# EAGLE design ESP01-1wire (EAGLE 7.5.0)
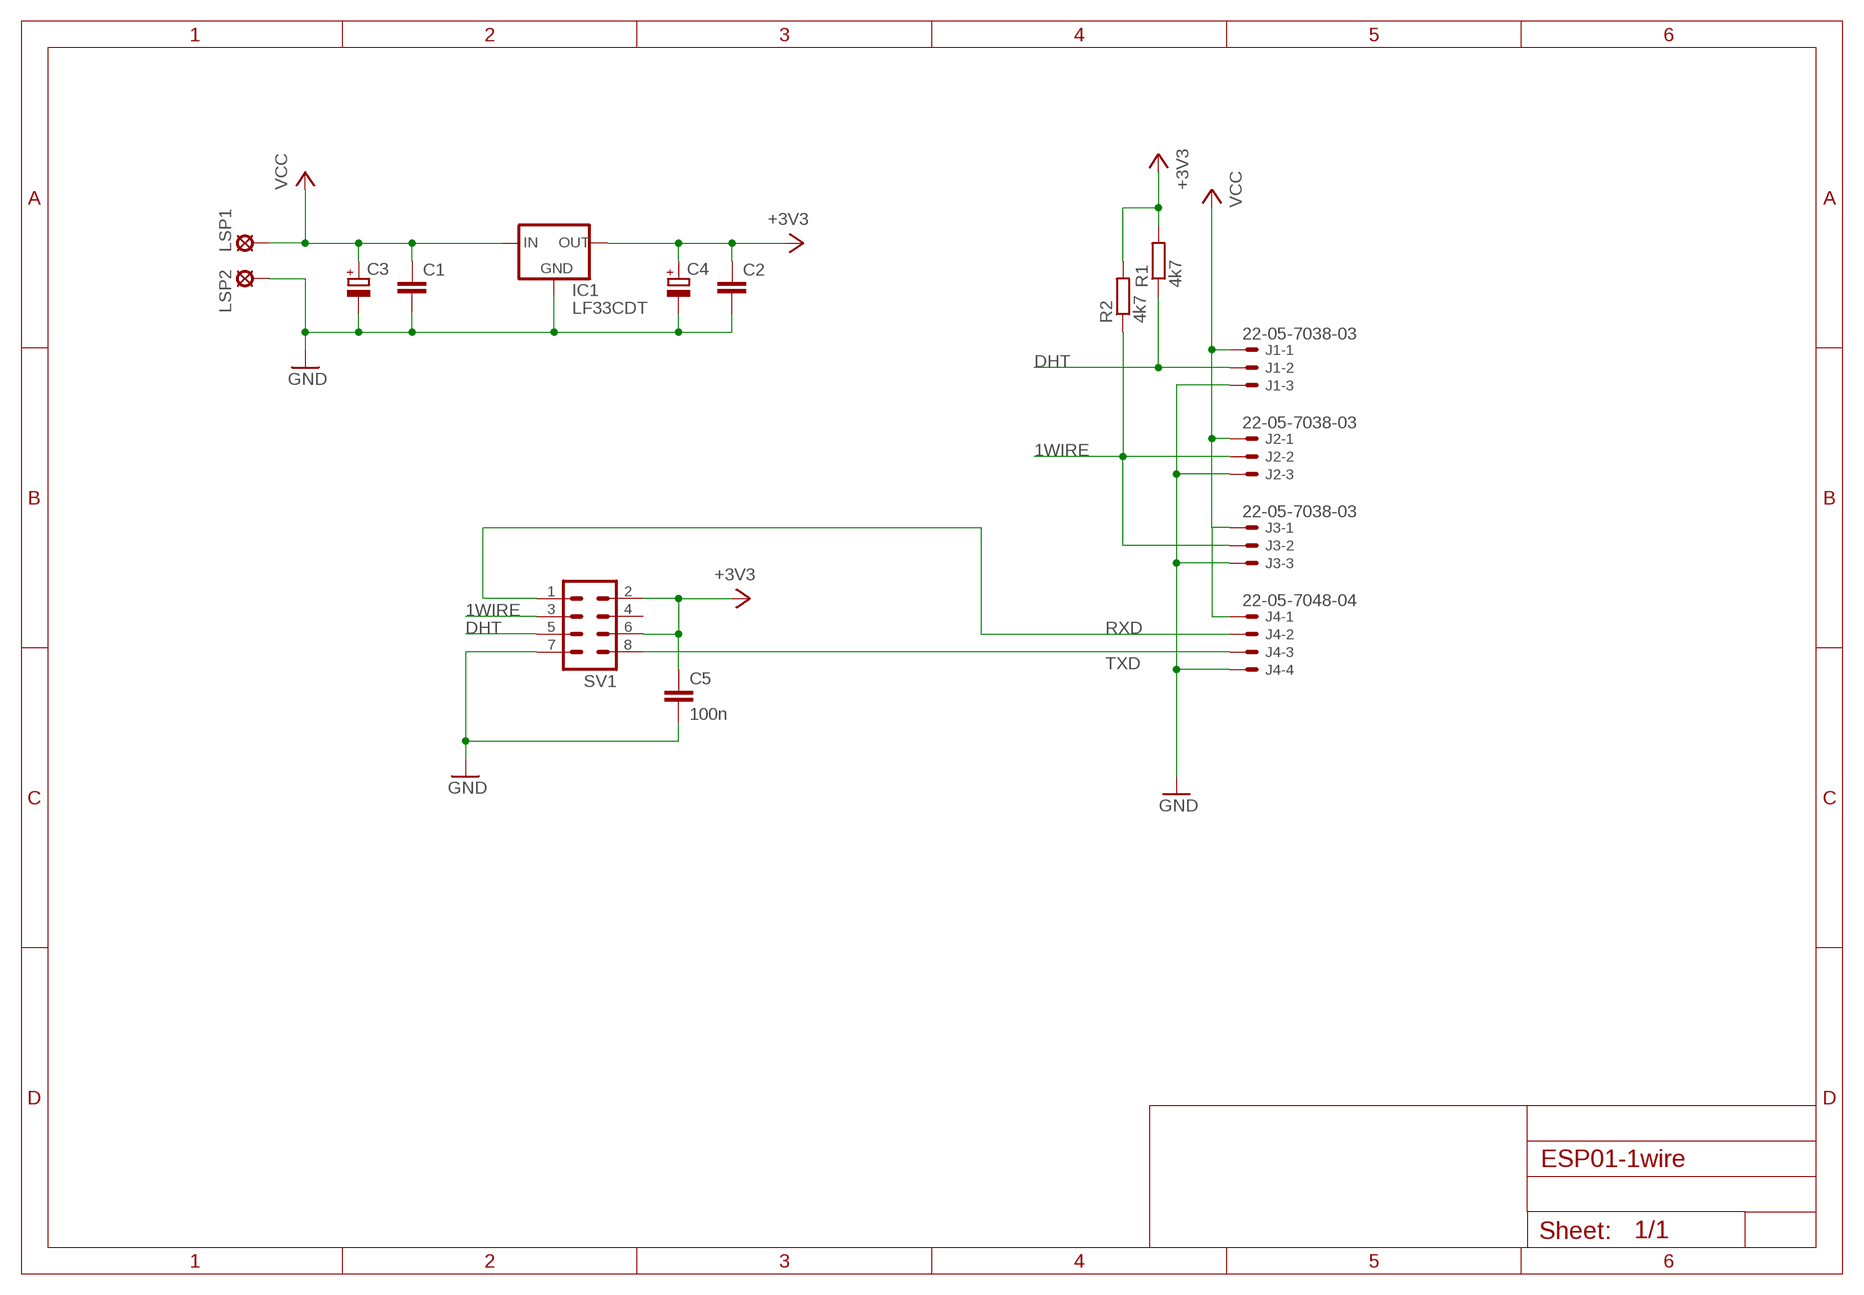
[diagram p0: schematic, sheet 1]

## Parts
C1  C-EUC0805  [C0805]
C2  C-EUC0805  [C0805]
C3  CPOL-EUSMCA  [SMC_A]
C4  CPOL-EUSMCA  [SMC_A]
C5  100n  C-EUC0805  [C0805]
IC1  LF33CDT  LP2950CDT-3.3  [DPACK]
J1  22-05-7038-03  [7395-03]
J2  22-05-7038-03  [7395-03]
J3  22-05-7038-03  [7395-03]
J4  22-05-7048-04  [7395-04]
LSP1  LSP10  [LSP10]
LSP2  LSP10  [LSP10]
R1  4k7  R-EU_R0805  [R0805]
R2  4k7  R-EU_R0805  [R0805]
SV1  MA04-2  [MA04-2]

## Nets
1WIRE: J2.2 J3.2 R2.1 SV1.3
+3V3: C2.1 C4.+ C5.1 IC1.3(OUT) R1.2 R2.2 SV1.2 SV1.6
DHT: J1.2 R1.1 SV1.5
GND: C1.2 C2.2 C3.- C4.- C5.2 IC1.4(GND) J1.3 J2.3 J3.3 J4.4 LSP2.MP SV1.7
RXD: J4.2 SV1.1
TXD: J4.3 SV1.8
VCC: C1.1 C3.+ IC1.1(IN) J1.1 J2.1 J3.1 J4.1 LSP1.MP
Unconnected: SV1.4

## Library data of the parts
C1 C2 C5 = rcl:C-EU: CAPACITOR, European symbol
C3 C4 = rcl:CPOL-EU: POLARIZED CAPACITOR, European symbol
IC1 = v-reg:LP2950?*: Source: http://cache.national.com/ds/LP/LP2950.pdf
J1-J3 = con-molex:22-?-03: CONNECTOR wire to board 2.54 mm (.1 inch) pitch header; OC_FARNELL: unknown; OC_NEWARK: unknown
J4 = con-molex:22-?-04: CONNECTOR wire to board 2.54 mm (.1 inch) pitch header; OC_FARNELL: unknown; OC_NEWARK: unknown
LSP1 LSP2 = solpad:LSP10: SOLDER PAD drill 1.0 mm, distributor Buerklin, 12H555
R1 R2 = rcl:R-EU_: RESISTOR, European symbol
SV1 = con-lstb:MA04-2: PIN HEADER; OC_FARNELL: unknown; OC_NEWARK: unknown

## Board
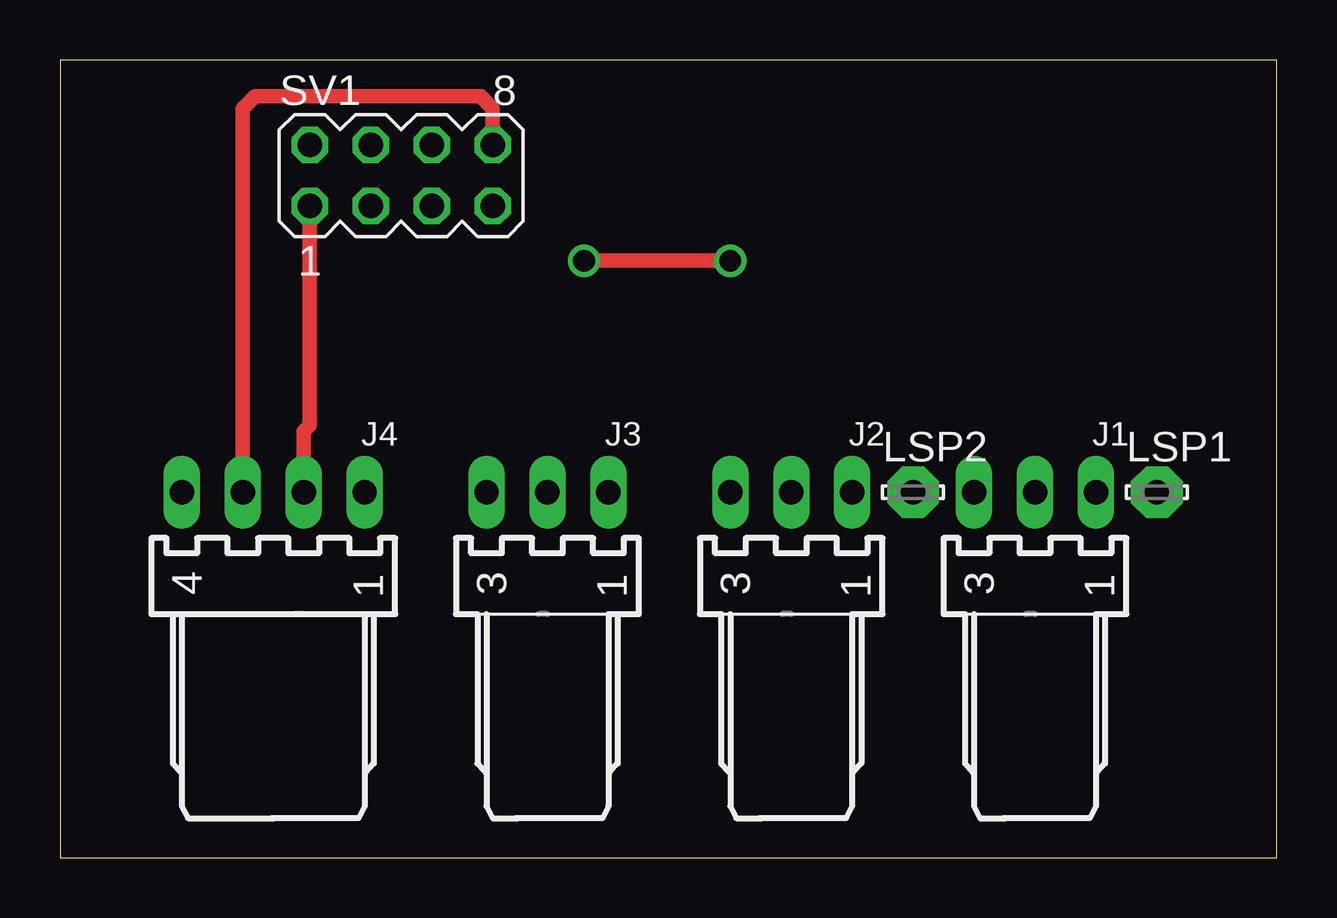
[diagram p1: board, top side]
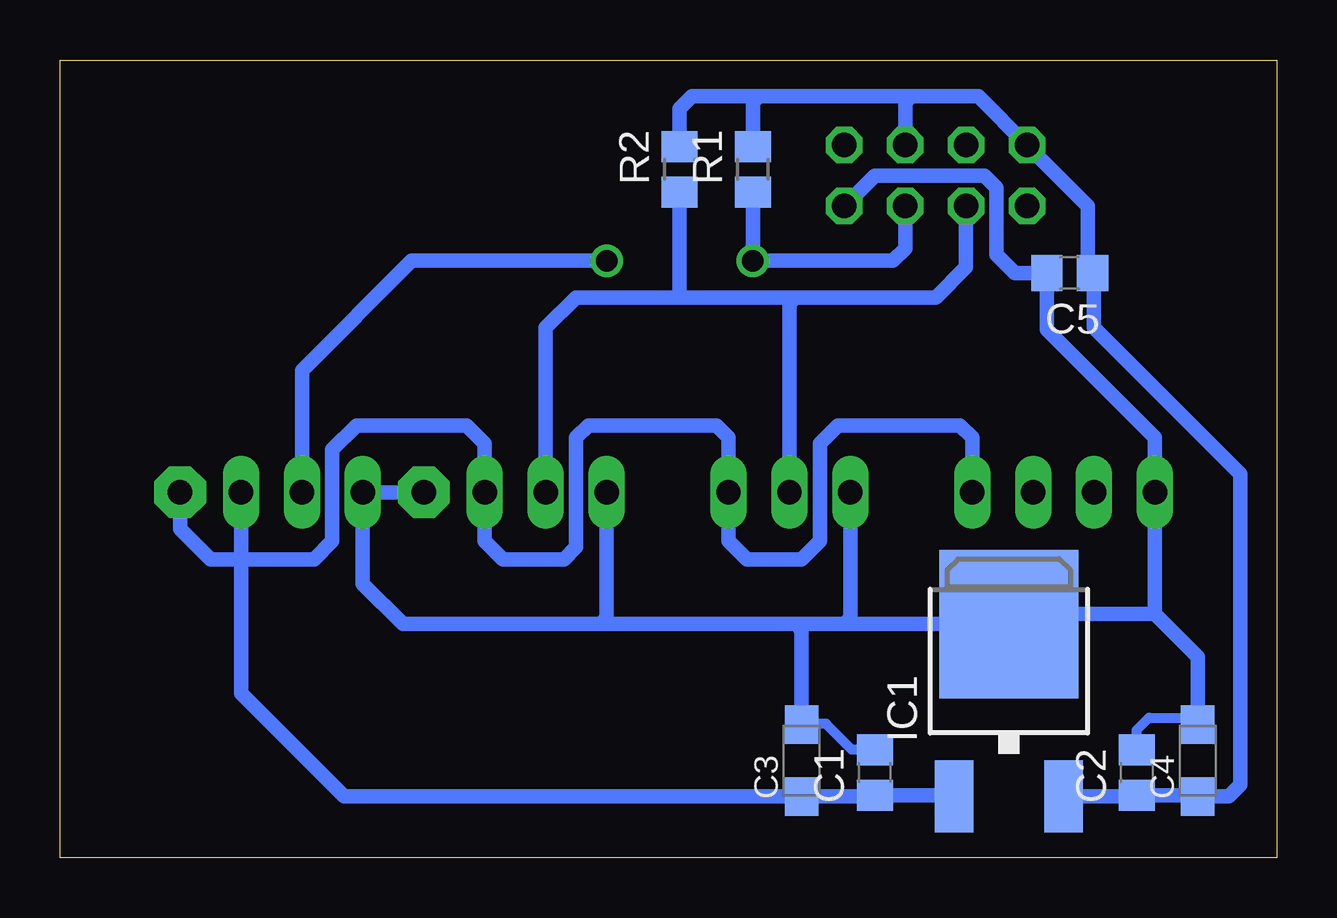
[diagram p2: board, bottom side, seen from below]

Size 50.72 x 33.26 mm. Coordinates in mm from the lower left corner, seen from the top.
Outline: 0,0 50.72,0 50.72,33.26 0,33.26 0,0
Copper layers (1*16): Top 0.035mm / dielectric 1.5mm / Bottom 0.035mm
Design rules "default": minimum track width 10mil, minimum drill 24mil, track to track 8mil, track to pad 8mil, pad to pad 8mil, via to via 8mil, smd to smd 8mil, copper to edge 40mil, drill to drill 8mil, minimum pad ring 10mil, minimum via ring 8mil, stop-mask expansion 4mil, vias tented up to drill 0mil, thermal gap 10mil

### Footprints (pad centres in the part's own frame; a part is rotated, then mirrored left to right if it is on the bottom)
C0805 = smd 1.3 x 1.5: 1 -0.95,0; 2 0.95,0
SMC_A = smd 1.6 x 1.4: + -1.5,0; - 1.5,0
DPACK = smd 1.6 x 3: 1 -2.28,-4.8; 3 2.28,-4.8 | smd 5.8 x 6.2: 4 0,2.38
7395-03 = drill 1.016 long: 1 2.54,0; 2 0,0; 3 -2.54,0
7395-04 = drill 1.016 long: 1 3.81,0; 2 1.27,0; 3 -1.27,0; 4 -3.81,0
LSP10 = drill 1.016 pad 2.159 octagon: MP 0,0
R0805 = smd 1.3 x 1.5: 1 -0.95,0; 2 0.95,0
MA04-2 = drill 1.016 octagon: 1 -3.81,-1.27; 2 -3.81,1.27; 3 -1.27,-1.27; 4 -1.27,1.27; 5 1.27,-1.27; 6 1.27,1.27; 7 3.81,-1.27; 8 3.81,1.27

### Placement (x,y rotation side)
C1  16.76,3.56 90 bottom
C2  5.84,3.56 90 bottom
C3  19.81,4.06 90 bottom
C4  3.3,4.06 90 bottom
C5  8.64,24.38 180 bottom
IC1  11.18,7.37 0 bottom
J1  40.64,15.24 0 top
J2  30.48,15.24 0 top
J3  20.32,15.24 0 top
J4  8.89,15.24 0 top
LSP1  45.72,15.24 0 top
LSP2  35.56,15.24 0 top
R1  21.84,28.7 90 bottom
R2  24.89,28.7 90 bottom
SV1  14.22,28.45 0 top

### Tracks (layer width: path | path; a pad name or v marks a point on that pad's centre or on a via)
1WIRE
  Bottom 0.61: SV1.3 12.95,24.64 14.22,23.37 20.07,23.37 | 20.07,23.37 24.89,23.37 | 24.89,23.37 29.21,23.37 30.48,22.1 J2.2 | J3.2 20.32,23.11 20.07,23.37 | R2.1 24.89,23.37
+3V3
  Bottom 0.61: IC1.3 5.84,2.57 C2.1 3.3,2.61 C4.+ 2.01,2.56 1.52,3.05 1.52,16 7.62,22.1 7.62,24.32 C5.1 7.87,24.57 7.87,27.18 SV1.2 12.45,31.75 15.24,31.75 | 15.24,31.75 21.59,31.75 | 21.59,31.75 24.38,31.75 24.89,31.24 R2.2 | SV1.6 15.49,31.5 15.24,31.75 | R1.2 21.84,31.5 21.59,31.75
DHT  (via drill 0.9 pad 0.81)
  Top 0.61: v21.84,24.89 v27.94,24.89
  Bottom 0.61: SV1.5 15.49,25.4 16,24.89 v21.84,24.89 R1.1 | v27.94,24.89 36.07,24.89 40.64,20.32 J1.2
GND
  Bottom 0.406: C2.2 5.84,5.33 5.33,5.84 3.58,5.84 C4.- | C1.2 17.71,4.51 18.8,5.59 19.79,5.59 C3.-
  Bottom 0.61: C4.- 3.3,8.38 5.08,10.16 | 5.08,10.16 J4.4 5.08,17.53 9.59,22.03 C5.2 10.92,24.38 11.68,25.15 11.68,27.94 12.19,28.45 16.76,28.45 SV1.7 | 5.08,10.16 10.76,10.16 IC1.4 18.03,9.75 | 18.03,9.75 20.07,9.75 | 20.07,9.75 28.19,9.75 | 28.19,9.75 36.42,9.75 38.1,11.43 J1.3 LSP2.MP | C3.- 19.81,9.49 20.07,9.75 | J2.3 27.94,10 28.19,9.75 | J3.3 17.78,10 18.03,9.75
RXD
  Top 0.61: SV1.1 10.41,18.03 10.16,17.78 J4.2
TXD
  Top 0.61: J4.3 7.62,31.24 8.13,31.75 17.53,31.75 18.03,31.24 SV1.8
VCC
  Bottom 0.61: IC1.1 13.46,2.61 C1.1 16.76,2.56 C3.+ 38.89,2.56 43.18,6.86 43.18,12.45 | 43.18,12.45 40.13,12.45 39.37,13.21 39.37,17.02 38.35,18.03 33.78,18.03 33.02,17.27 J2.1 33.02,13.21 32.26,12.45 29.72,12.45 29.21,12.95 29.21,17.53 28.7,18.03 23.37,18.03 22.86,17.53 J3.1 22.86,13.21 22.1,12.45 19.81,12.45 19.05,13.21 19.05,17.27 18.29,18.03 13.21,18.03 12.7,17.53 J4.1 | 43.18,12.45 44.45,12.45 45.72,13.72 LSP1.MP | J1.1 43.18,12.45